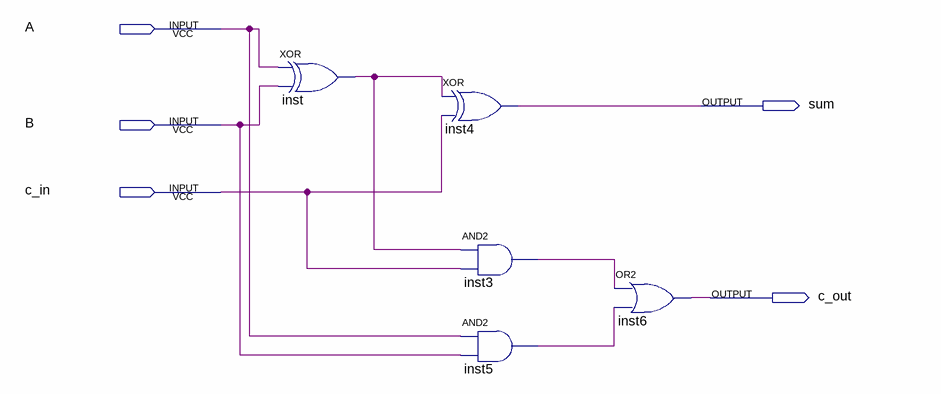
[diagram p0: schematic sheet]
// Quartus schematic full_adder_1bit.bdf as structural Verilog: 5 symbols, 5 pins
module full_adder_1bit (
  input  A,
  input  B,
  input  c_in,
  output sum,
  output c_out
);

  wire inst3_out, inst5_out, inst_out;

  xor inst (inst_out, A, B);
  xor inst4 (sum, inst_out, c_in);
  and inst3 (inst3_out, inst_out, c_in);
  and inst5 (inst5_out, A, B);
  or inst6 (c_out, inst3_out, inst5_out);
endmodule
